# Altium schematic sheet lichee0_base.SchDoc
size A3
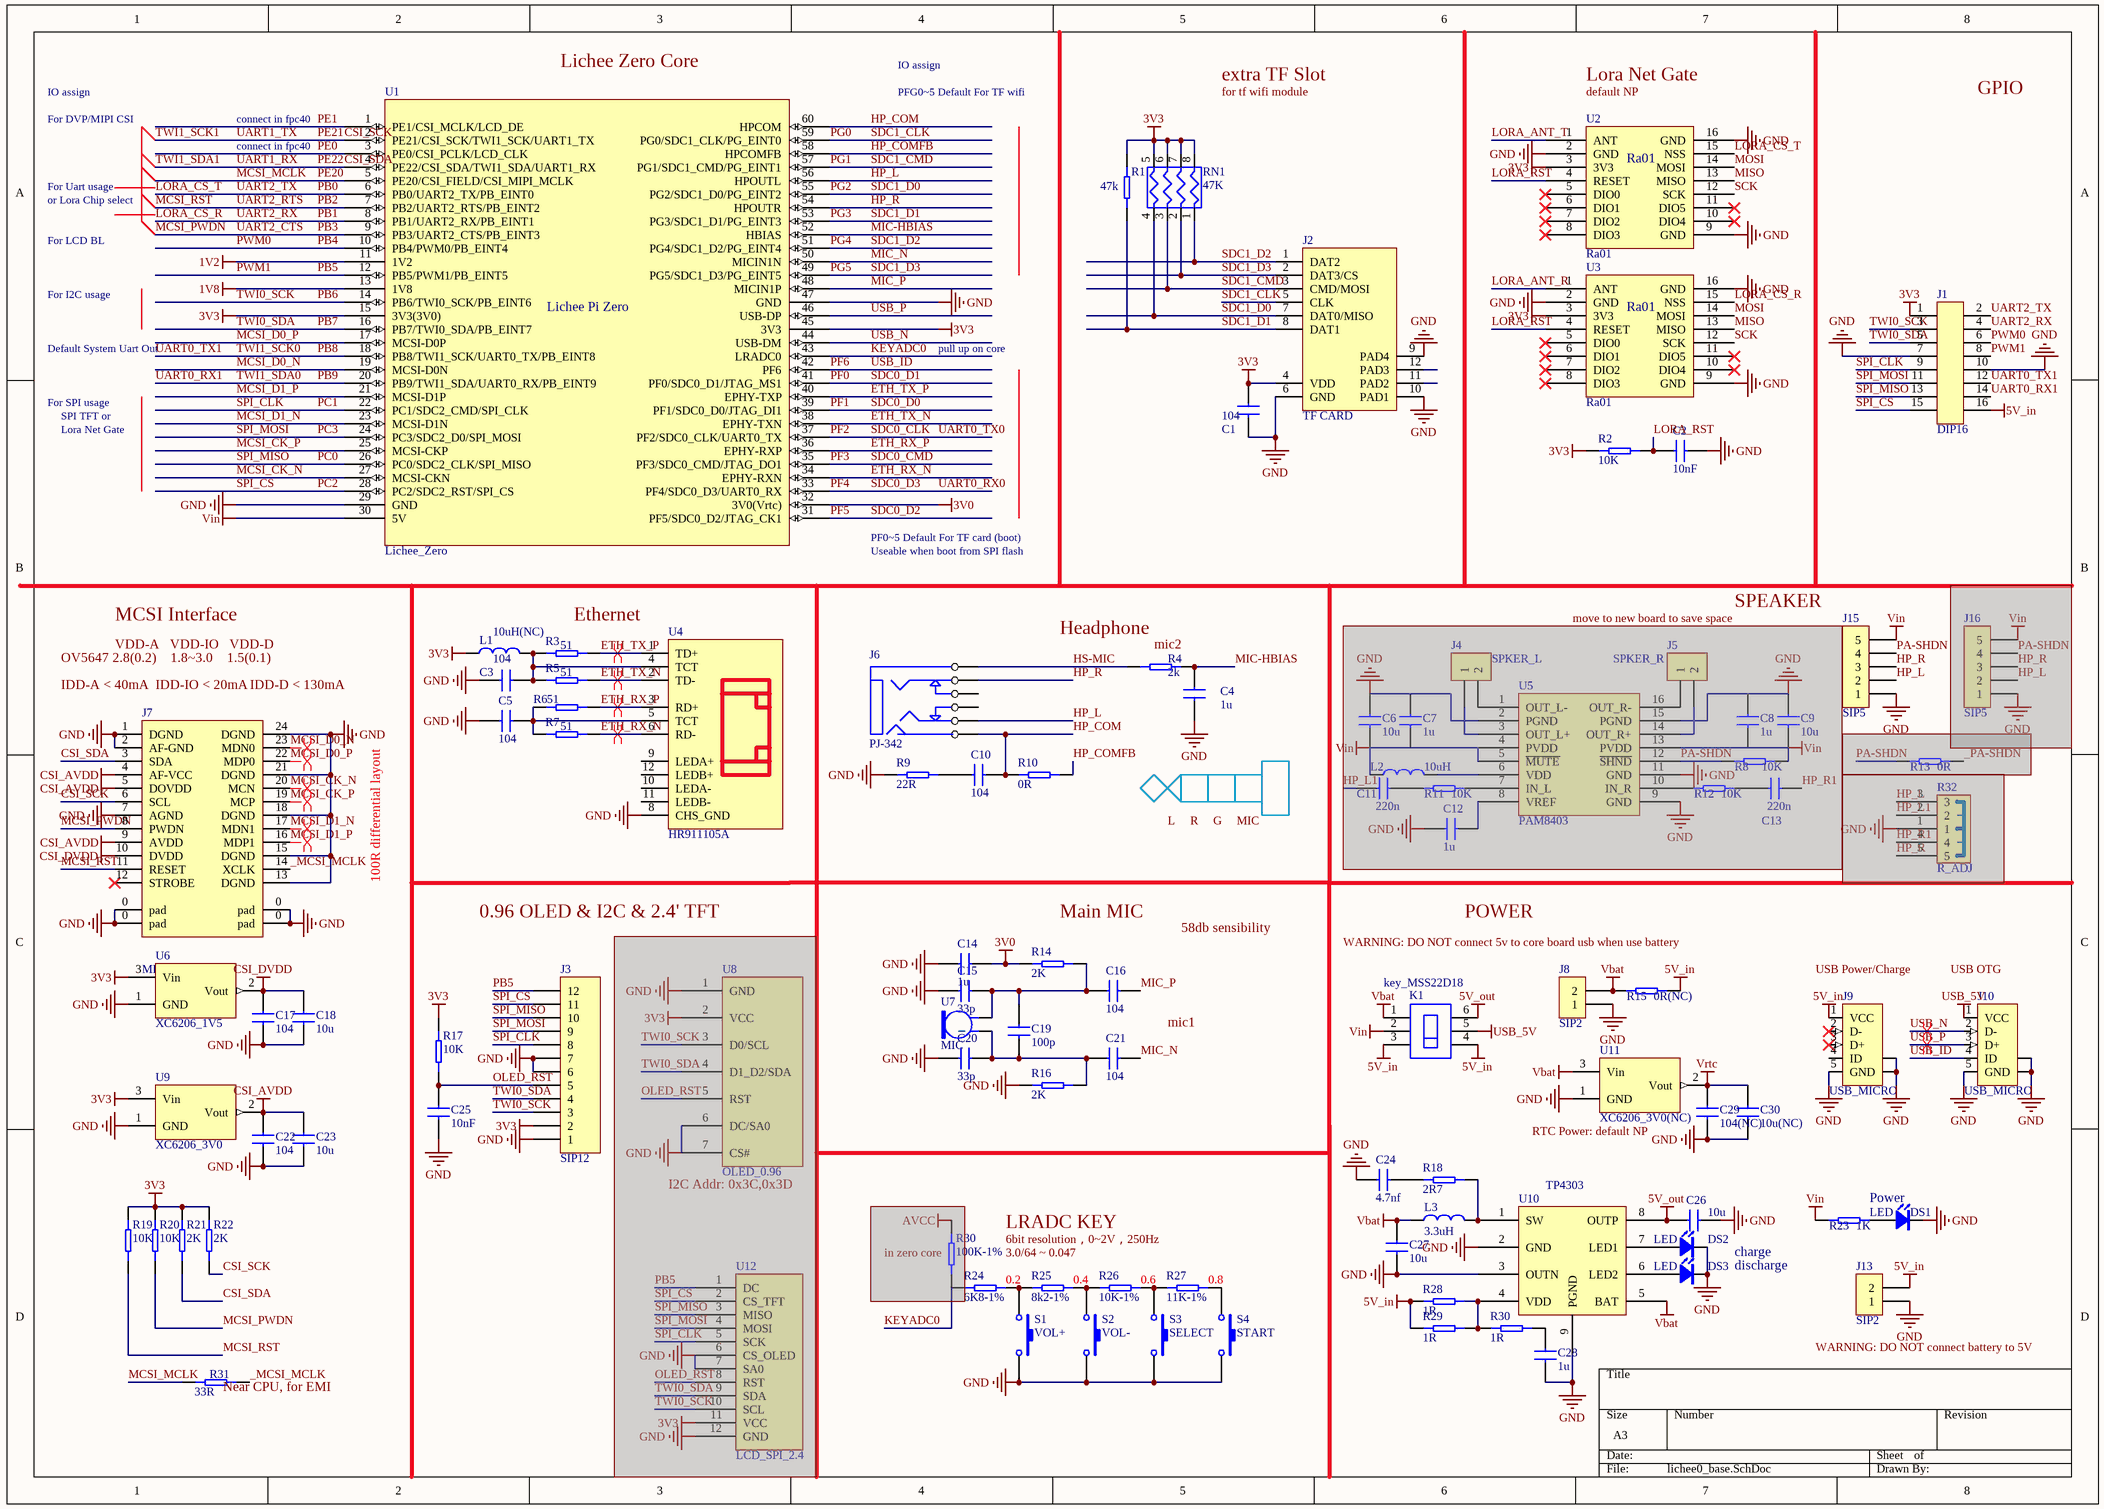
[diagram p0: lichee0_base.SchDoc]

## Parts
(Parts that share a designator on the sheet are numbered #1, #2 ... from top to bottom, then left to right.)
C1  104  [0402C]
C2  10nF  [0402C]
C3  104  [0402C]
C4  1u  [0402C]
C5  104  [0402C]
C6  10u  [0603C]  (masked out: inside a compile mask, not in the netlist)
C7  1u  [0402C]  (masked out: inside a compile mask, not in the netlist)
C8  1u  [0402C]  (masked out: inside a compile mask, not in the netlist)
C9  10u  [0603C]  (masked out: inside a compile mask, not in the netlist)
C10  104  [0402C]
C11  220n  [0402C]  (masked out: inside a compile mask, not in the netlist)
C12  1u  [0402C]  (masked out: inside a compile mask, not in the netlist)
C13  220n  [0402C]  (masked out: inside a compile mask, not in the netlist)
C14  1u  [0402C]
C15  33p  [0402C]
C16  104  [0402C]
C17  104  [0402C]
C18  10u  [0603C]
C19  100p  [0402C]
C20  33p  [0402C]
C21  104  [0402C]
C22  104  [0402C]
C23  10u  [0603C]
C24  4.7nf  [0402C]
C25  10nF  [0402C]
C26  10u  [0603C]
C27  10u  [0603C]
C28  1u  [0402C]
C29  104(NC)  [0402C]
C30  10u(NC)  [0603C]
DS1  LED  [0603D]
DS2  LED  [0603D]
DS3  LED  [0603D]
J1  DIP16  [DIP16-2.54]
J2  TF CARD  [TF_SHORT_wifi]
J3  SIP12  [SIP12-2.54]
J4  SPKER_L  [AWT_1.25_2P_LI]  (masked out: inside a compile mask, not in the netlist)
J5  SPKER_R  [AWT_1.25_2P_LI]  (masked out: inside a compile mask, not in the netlist)
J6  PJ-342  [PJ-342]
J7  MIPI_24  [AXE624124]
J8  SIP2  [SIP2-2.54]
J9  USB_MICRO  [USB_MICRO]
J10  USB_MICRO  [USB_MICRO]
J13  SIP2  [SIP2-2.54]
J15  SIP5  [SIP5_1.27]
J16  SIP5  [SIP5_1.27]  (masked out: inside a compile mask, not in the netlist)
K1  key_MSS22D18  [key_2*3]
L1  10uH(NC)  [0805R]
L2  10uH  [0805R]  (masked out: inside a compile mask, not in the netlist)
L3  3.3uH  [CD54NP]
R1  47k  [0402R]
R2  10K  [0402R]
R3  51  [0402R]
R4  2k  [0402R]
R5  51  [0402R]
R6  51  [0402R]
R7  51  [0402R]
R8  10K  [0402R]  (masked out: inside a compile mask, not in the netlist)
R9  22R  [0402R]
R10  0R  [0402R]
R11  10K  [0402R]  (masked out: inside a compile mask, not in the netlist)
R12  10K  [0402R]  (masked out: inside a compile mask, not in the netlist)
R13  0R  [0402R]  (masked out: inside a compile mask, not in the netlist)
R14  2K  [0402R]
R15  0R(NC)  [0402R]
R16  2K  [0402R]
R17  10K  [0402R]
R18  2R7  [0402R]
R19  10K  [0402R]
R20  10K  [0402R]
R21  2K  [0402R]
R22  2K  [0402R]
R23  1K  [0402R]
R24  6K8-1%  [0402R]
R25  8k2-1%  [0402R]
R26  10K-1%  [0402R]
R27  11K-1%  [0402R]
R28  1R  [0805R]
R29  1R  [0805R]
R30#1  100K-1%  [0402R]  (masked out: inside a compile mask, not in the netlist)
R30#2  1R  [0805R]
R31  33R  [0402R]
R32  R_ADJ  [Dual_R_adj]  (masked out: inside a compile mask, not in the netlist)
RN1  47K  [YC164]
S1  VOL+  [key4_3x4]
S2  VOL-  [key4_3x4]
S3  SELECT  [key4_3x4]
S4  START  [key4_3x4]
U1  Lichee_Zero  [Lichee_Zero_Half]
U2  Ra01  [Ra01]
U3  Ra01  [Ra01]
U4  HR911105A  [HR911105A]
U5  PAM8403  [SO-16N]  (masked out: inside a compile mask, not in the netlist)
U6  XC6206_1V5  [SOT-23]
U7  MIC  [MIC_6050]
U8  OLED_0.96  [OLED_0.96]  (masked out: inside a compile mask, not in the netlist)
U9  XC6206_3V0  [SOT-23]
U10  TP4303  [ESOP8L]
U11  XC6206_3V0(NC)  [SOT-23]
U12  LCD_SPI_2.4  [LCD_PCB_2.4]  (masked out: inside a compile mask, not in the netlist)

## Nets
1V2: U1.11(1V2)
1V8: U1.13(1V8)
3V0: C14.1 R14.2 U1.32(3V0(Vrtc))
3V3: C1.2 J1.1 J2.4(VDD) J3.2 L1.2 R1.2 R2.1 R17.1 R19.1 R20.1 R21.1 R22.1 RN1.5 RN1.6 RN1.7 RN1.8 U1.15(3V3(3V0)) U1.45(3V3) U2.3(3V3) U3.3(3V3) U6.3(Vin) U9.3(Vin)
5V_in: J1.16 J9.1(VCC) J13.2 K1.3(A3) K1.4(B3) R15.1 R28.1 R29.1
5V_out: C26.1 K1.6(B1) U10.8(OUTP)
CSI_AVDD: C22.2 C23.1 J7.4(AF-VCC) J7.5(DOVDD) J7.9(AVDD) U9.2(Vout)
CSI_DVDD: C17.2 C18.1 J7.10(DVDD) U6.2(Vout)
GND: C1.1 C2.1 C3.1 C4.1 C5.1 C14.2 C15.1 C17.1 C18.2 C20.1 C22.1 C23.2 C24.1 C25.1 C26.2 C27.1 C28.1 C29.1 C30.2 DS1.K DS2.K DS3.K J1.7 J1.10 J2.6(GND) J2.9(PAD4) J2.10(PAD1) J3.1 J3.6 J3.7 J7.0(pad) J7.1(DGND) J7.2(AF-GND) J7.7(AGND) J7.13(DGND) J7.15(DGND) J7.18(DGND) J7.21(DGND) J7.24(DGND) J8.1 J9.5(GND) J9.6(SHLD) J9.7(SHLD) J10.5(GND) J10.6(SHLD) J10.7(SHLD) J13.1 J15.1 R9.1 R16.2 S1.1 S2.1 S3.1 S4.1 U1.29(GND) U1.47(GND) U2.2(GND) U2.9(GND) U2.16(GND) U3.2(GND) U3.9(GND) U3.16(GND) U4.8(CHS_GND) U6.1(GND) U9.1(GND) U10.2(GND) U10.3(OUTN) U10.9(PGND) U11.1(GND)
USB_5V: J10.1(VCC) K1.5(B2)
Vbat: C27.2 J8.2 K1.1(A1) L3.2 R15.2 U10.5(BAT) U11.3(Vin)
Vin: J15.5 K1.2(A2) R23.2 U1.30(5V)
Vrtc: C29.2 C30.1 U11.2(Vout)
_MCSI_MCLK: J7.14(XCLK) R31.2
CSI_SCK: J7.6(SCL) R22.2 U1.2(PE21/CSI_SCK/TWI1_SCK/UART1_TX)  [also labelled PE21, TWI1_SCK1, UART1_TX]
CSI_SDA: J7.3(SDA) R21.2 U1.4(PE22/CSI_SDA/TWI1_SDA/UART1_RX)  [also labelled PE22, TWI1_SDA1, UART1_RX]
ETH_RX_N: R7.2 U1.34(EPHY-RXN) U4.6(RD-)
ETH_RX_P: R6.2 U1.36(EPHY-RXP) U4.3(RD+)
ETH_TX_N: R5.1 U1.38(EPHY-TXN) U4.2(TD-)
ETH_TX_P: R3.1 U1.40(EPHY-TXP) U4.1(TD+)
HP_COM: C10.2 J6.3(GND) R10.1 U1.60(HPCOM)
HP_COMFB: R10.2 U1.58(HPCOMFB)
HP_L: J6.6(L) J15.2 U1.56(HPOUTL)
HP_R: J6.4(R) J15.3 U1.54(HPOUTR)
HS-MIC: J6.2(MIC) R4.2
KEYADC0: R24.2 U1.43(LRADC0)
LORA_ANT_R: U3.1(ANT)
LORA_ANT_T: U2.1(ANT)
LORA_CS_R: J1.4 U1.8(PB1/UART2_RX/PB_EINT1) U3.15(NSS)  [also labelled PB1, UART2_RX]
LORA_CS_T: J1.2 U1.6(PB0/UART2_TX/PB_EINT0) U2.15(NSS)  [also labelled PB0, UART2_TX]
LORA_RST: C2.2 R2.2 U2.4(RESET) U3.4(RESET)
MCSI_CK_N: J7.20(MCN) U1.27(MCSI-CKN)
MCSI_CK_P: J7.19(MCP) U1.25(MCSI-CKP)
MCSI_D0_N: J7.23(MDN0) U1.19(MCSI-D0N)
MCSI_D0_P: J7.22(MDP0) U1.17(MCSI-D0P)
MCSI_D1_N: J7.17(MDN1) U1.23(MCSI-D1N)
MCSI_D1_P: J7.16(MDP1) U1.21(MCSI-D1P)
MCSI_MCLK: R31.1 U1.5(PE20/CSI_FIELD/CSI_MIPI_MCLK)  [also labelled PE20]
MCSI_PWDN: J7.8(PWDN) R20.2 U1.9(PB3/UART2_CTS/PB_EINT3)  [also labelled PB3, UART2_CTS]
MCSI_RST: J7.11(RESET) R19.2 U1.7(PB2/UART2_RTS/PB_EINT2)  [also labelled PB2, UART2_RTS]
MIC-HBIAS: C4.2 R4.1 U1.52(HBIAS)
MIC_N: C21.2 U1.50(MICIN1N)
MIC_P: C16.2 U1.48(MICIN1P)
MISO: U2.13(MISO) U3.13(MISO)
MOSI: U2.14(MOSI) U3.14(MOSI)
OLED_RST: C25.2 J3.5 R17.2
PA-SHDN: J15.4
PB4: J1.6 U1.10(PB4/PWM0/PB_EINT4)  [also labelled PWM0]
PB5: J1.8 J3.12 U1.12(PB5/PWM1/PB_EINT5)  [also labelled PWM1]
PB6: J1.3 J3.3 U1.14(PB6/TWI0_SCK/PB_EINT6)  [also labelled TWI0_SCK]
PB7: J1.5 J3.4 U1.16(PB7/TWI0_SDA/PB_EINT7)  [also labelled TWI0_SDA]
PB8: J1.12 U1.18(PB8/TWI1_SCK/UART0_TX/PB_EINT8)  [also labelled TWI1_SCK0, UART0_TX1]
PB9: J1.14 U1.20(PB9/TWI1_SDA/UART0_RX/PB_EINT9)  [also labelled TWI1_SDA0, UART0_RX1]
PC0: J1.13 J3.10 U1.26(PC0/SDC2_CLK/SPI_MISO)  [also labelled SPI_MISO]
PC1: J1.9 J3.8 U1.22(PC1/SDC2_CMD/SPI_CLK)  [also labelled SPI_CLK]
PC2: J1.15 J3.11 U1.28(PC2/SDC2_RST/SPI_CS)  [also labelled SPI_CS]
PC3: J1.11 J3.9 U1.24(PC3/SDC2_D0/SPI_MOSI)  [also labelled SPI_MOSI]
PE0: U1.3(PE0/CSI_PCLK/LCD_CLK)
PE1: U1.1(PE1/CSI_MCLK/LCD_DE)
PF0: U1.41(PF0/SDC0_D1/JTAG_MS1)  [also labelled SDC0_D1]
PF1: U1.39(PF1/SDC0_D0/JTAG_DI1)  [also labelled SDC0_D0]
PF2: U1.37(PF2/SDC0_CLK/UART0_TX)  [also labelled SDC0_CLK, UART0_TX0]
PF3: U1.35(PF3/SDC0_CMD/JTAG_DO1)  [also labelled SDC0_CMD]
PF4: U1.33(PF4/SDC0_D3/UART0_RX)  [also labelled SDC0_D3, UART0_RX0]
PF5: U1.31(PF5/SDC0_D2/JTAG_CK1)  [also labelled SDC0_D2]
PF6: J10.4(ID) U1.42(PF6)  [also labelled USB_ID]
PG0: J2.5(CLK) U1.59(PG0/SDC1_CLK/PG_EINT0)  [also labelled SDC1_CLK]
PG1: J2.3(CMD/MOSI) RN1.3 U1.57(PG1/SDC1_CMD/PG_EINT1)  [also labelled SDC1_CMD]
PG2: J2.7(DAT0/MISO) RN1.4 U1.55(PG2/SDC1_D0/PG_EINT2)  [also labelled SDC1_D0]
PG3: J2.8(DAT1) R1.1 U1.53(PG3/SDC1_D1/PG_EINT3)  [also labelled SDC1_D1]
PG4: J2.1(DAT2) RN1.1 U1.51(PG4/SDC1_D2/PG_EINT4)  [also labelled SDC1_D2]
PG5: J2.2(DAT3/CS) RN1.2 U1.49(PG5/SDC1_D3/PG_EINT5)  [also labelled SDC1_D3]
SCK: U2.12(SCK) U3.12(SCK)
USB_N: J10.2(D-) U1.44(USB-DM)
USB_P: J10.3(D+) U1.46(USB-DP)
NetC3_2: C3.2 L1.1 R3.2 R5.2 U4.4(TCT)
NetC5_2: C5.2 R6.1 R7.1 U4.5(TCT)
NetC10_1: C10.1 R9.2
NetC15_2: C15.2 C16.1 C19.1 R14.1 U7.2
NetC19_2: C19.2 C20.2 C21.1 R16.1 U7.1
NetC24_2: C24.2 R18.1
NetC28_2: C28.2 R30#2.1
NetDS1_A: DS1.A R23.1
NetDS2_A: DS2.A U10.7(LED1)
NetDS3_A: DS3.A U10.6(LED2)
NetL3_1: L3.1 R18.2 U10.1(SW)
NetR24_1: R24.1 R25.2 S1.2
NetR25_1: R25.1 R26.2 S2.2
NetR26_1: R26.1 R27.2 S3.2
NetR27_1: R27.1 S4.2
NetR28_2: R28.2 R29.2 R30#2.2 U10.4(VDD)

Not connected (* = marked no-connect by the designer): J2 11(PAD2) 12(PAD3); J6 5(R_DET) 7(L_DET); J7 12(STROBE)*; J9 2(D-)* 3(D+)* 4(ID); U2 5(DIO0)* 6(DIO1)* 7(DIO2)* 8(DIO3)* 10(DIO4)* 11(DIO5)*; U3 5(DIO0)* 6(DIO1)* 7(DIO2)* 8(DIO3)* 10(DIO4)* 11(DIO5)*; U4 7(NC) 9(LEDA+) 10(LEDA-) 11(LEDB-) 12(LEDB+)

## Layout directives
differential pair: ETH_RX_N, ETH_RX_P, ETH_TX_N, ETH_TX_P, MCSI_CK_N, MCSI_CK_P, MCSI_D0_N, MCSI_D0_P, MCSI_D1_N, MCSI_D1_P, USB_N, USB_P

## Notes on the sheet
- IO assign
- Lichee Zero Core
- PFG0~5 Default For TF wifi
- for tf wifi module
- extra TF Slot
- Lora Net Gate
- (near U2) default NP
- GPIO
- For DVP/MIPI CSI
- connect in fpc40
- For LCD BL
- For Uart usage
- or Lora Chip select
- For I2C usage
- Default System Uart Out
- pull up on core
- For SPI usage
- SPI TFT or
- PF0~5 Default For TF card (boot)
- Useable when boot from SPI flash
- VDD-A   VDD-IO   VDD-D
- MCSI Interface
- Ethernet
- (near J6) Headphone
- (near R4) mic2
- move to new board to save space
- SPEAKER
- OV5647 2.8(0.2)    1.8~3.0    1.5(0.1)
- (near J7) IDD-A < 40mA
- (near J7) IDD-IO < 20mA
- (near J7) IDD-D < 130mA
- L     R     G     MIC
- 100R differential layout
- 0.96 OLED & I2C & 2.4' TFT
- Main MIC
- POWER
- (near R14) 58db sensibility
- WARNING: DO NOT connect 5v to core board usb when use battery
- (near J9) USB Power/Charge
- (near J10) USB OTG
- mic1
- (near U8) I2C Addr: 0x3C,0x3D
- (near U11) RTC Power: default NP
- (near R30#1) in zero core
- 6bit resolution，0~2V，250Hz
- LRADC KEY
- 3.0/64 ~ 0.047
- charge
- Power
- (near R24) 0.2
- (near R25) 0.4
- (near R26) 0.6
- (near R27) 0.8
- discharge
- (near R31) Near CPU, for EMI
- (near J13) WARNING: DO NOT connect battery to 5V
- (in symbol Lichee_Zero_Half) Lichee Pi Zero

## Library data of the parts
C1-C30 = CAP: SMD-CAP
J1 = DIP16: Connectors; Set Position: 0.5; Published: 8-Jun-2000; LatestRevisionDate: 17-Jul-2002; LatestRevisionNote: Re-released for DXP Platform.; PackageReference: AXIAL-0.6; Publisher: Altium Limited
J2 = SD_Card_flip
J3 = SIP12: jointbar
J4 J5 J8 J13 = SIP2: jointbar
J7 = MIPI_24DS
J15 J16 = SIP5: jointbar
L1-L3 = L1: 电感
R1-R29 R30#1 R30#2 R31 = R
R32 = R_DUAL_adj
RN1 = RES_PACK_SMD08
S1-S4 = SW-PB: Switch; Published: 24-Mar-1999; LatestRevisionDate: 17-Jul-2002; LatestRevisionNote: Re-released for DXP Platform.; PackageReference: SPST-2; Publisher: Altium Limited
U1 = Lichee_Zero_Half
U2 U3 = LORA_01
U6 U9 U11 = XC6206: 3.3V